# EasyEDA Pro project ProPrj_无线即时通信_2025-03-31.epro, board 生产板
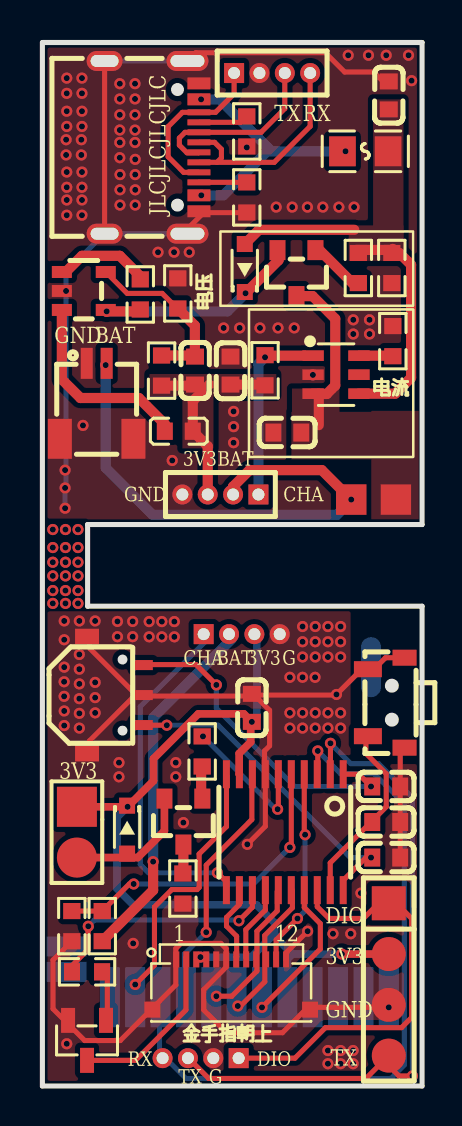
[diagram p8: board, top side]
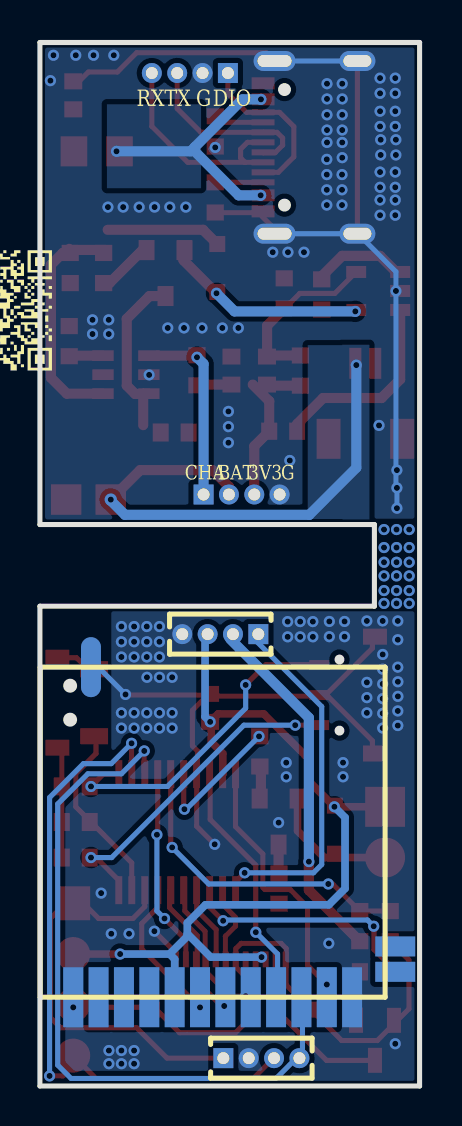
[diagram p9: board, bottom side, seen from below]

Outline 19.02 x 52.2 mm; copper layers: Top Layer, Bottom Layer. Coordinates in mm from the lower left corner of the outline.
Outline path: 0,52.2 0,0 19.02,0 19.02,24 2.26,24 2.26,28.09 19.02,28.09 19.02,52.2 0,52.2
Stack: Top Layer 0.035mm - / Dielectric1 1.51mm FR4 er 4.5 / Bottom Layer 0.035mm -

## Design rules (mm)
template: 自定义配置
spacing copperThickness1oz (default): track to track 0.102, other pairs 0.152 to 0.3
spacing copperThickness2oz: track to track 0.203, other pairs 0.152 to 0.3
track width copperThickness1oz (default): min 0.127, default 0.254, max 2.54
track width copperThickness2oz: min 0.203, default 0.254, max 2.54
differential pair differentialPair (default): width min 0.127, default 0.254, max 2.54; gap min 0.152, default 0.152
via viaSize (default): diameter min 0.5, default 0.61, max 10; hole min 0.3, default 0.305, max 6.3

## Placement (name value [footprint] x y rotation side)
C2  100nF  [C0603]  10.49 18.92 270 top
C10  100nF  [C0603]  17.22 14.98 0 top
C11  100nF  [C0603]  17.22 11.43 0 top
C32  4.7uf  [C0603]  17.35 49.55 270 top
C40  47pF  [C0603]  7.64 35.79 270 top
C41  22uf  [C0603]  9.42 35.79 90 top
C56  100nF  [C0603]  17.22 13.21 0 top
C57  1uf  [C0603]  12.27 32.69 0 top
D6  B5819WS  [SOD-323F_L1.7-W1.3-LS2.5-R-RD-1]  10.13 40.92 90 top
D7  B5819WS  [SOD-323F_L1.7-W1.3-LS2.5-R-RD-1]  4.24 12.82 270 top
FPC1  AFH34-S12FIA-1H  [FPC-SMD_12P-P0.50_THD0509-12CL-GF]  9.46 5.08 0 top
H1  PZ254V-11-02P  [HDR-TH_2P-P2.54-V-M]  1.73 12.7 270 top
H2  PZ254V-11-04P  [HDR-TH_4P-P2.54-V-M]  17.35 5.33 270 top
H3  PZ127V-11-04-0720  [HDR-TH_4P-P1.27-V-M]  7.92 1.39 180 bottom
H4  PZ127V-11-04-0720  [HDR-TH_4P-P1.27-V-M]  9.98 22.6 0 bottom
L15  2.2uH  [L0603]  6.83 32.75 180 top
Q6  AO3401A  [SOT-23_L2.9-W1.3-P0.95-LS2.4-BR]  7.06 13.23 90 top
Q7  AO3401A  [SOT-23_L2.9-W1.3-P0.95-LS2.4-BR]  12.72 40.66 90 top
R4  1MΩ  [R0603]  3 8 270 top
R5  1MΩ  [R0603]  1.47 8 90 top
R45  200k  [R0603]  5.97 35.79 270 top
R46  100k  [R0603]  6.78 39.65 270 top
R47  100kΩ  [R0603]  4.9 39.6 90 top
R58  5.1kΩ  [R0603]  10.24 44.45 270 top
R59  5.1kΩ  [R0603]  10.24 47.75 270 top
R62  2.2k  [R0603]  2.23 5.71 0 top
R63  100kΩ  [R0603]  17.5 40.92 90 top
R64  100kΩ  [R0603]  15.82 40.92 270 top
R65  10k  [R0603]  7.04 9.88 270 top
R66  30k  [R0603]  17.55 37.26 270 top
R67  10k  [R0603]  11.15 35.8 90 top
R68  100欧  [R0603]  8 16.74 270 top
SW3  TS24CA 250gf 013  [SW-SMD_L4.7-W3.5-P3.35-EH]  17.22 19.17 270 top
U1  CH32V003F4P6(TSSOP20)  [OLIMEX_IC-FP:TSSOP20_Pitch-0.65mm_6.6x4.5x1.2mm]  12.14 12.7 180 top
U8  SL0805200  [F0805]  16.17 46.75 0 top
U22  ETA3425S2F  [SOT-23-5_L2.9-W1.6-P0.95-LS2.8-BL]  2.07 39.77 270 top
U23  -  [e5e8]  2.49 19.56 90 top
U24  XL1278-SMT  [SX1278]  10.36 12.7 180 bottom
U25  SS8050  [SOT-23-3_L2.9-W1.3-P1.90-LS2.4-BR]  2.23 2.28 90 top
U29  CS-1254R-02  [CONN-SMD_2P-P1.00_CS-1254R-02]  2.72 34.26 0 top
U30  -  [水银开关]  16.59 29.33 90 top
U35  X1311FV-04-C43D24  [HDR-TH_4P-P1.27-V-F]  11.51 50.67 0 top
U36  X1311FV-04-C43D24  [HDR-TH_4P-P1.27-V-F]  8.91 29.59 180 top
U37  TP4057-42-SOT26-R  [SOT-23-6_L2.9-W1.6-P0.95-LS2.8-BL]  14.71 35.58 270 top
USB2  TYPE-C16PIN  [USB-C-SMD_TYPE-C16PIN]  5.48 46.95 270 top

## Footprints (pads in the part's own frame, mm; a bottom-side part is the same pattern mirrored in y, then rotated)
C0603
  rect 0.8x0.9 smd: 1(-0.7,0) 2(0.7,0)
CONN-SMD_2P-P1.00_CS-1254R-02
  rect 0.6x1.55 smd: 1(-0.5,1.887) 2(0.5,1.887)
  rect 1.2x2 smd: 3(-1.841,-1.887) 4(1.841,-1.887)
e5e8
  rect 0.5x1 smd: 1(-1.5,-2.54) 2(0,-2.54) 3(1.5,-2.54)
  rect 0.8x1.2 smd: 4(-2.921,0.254) 5(2.921,0.254)
F0805
  rect 1.335x1.5 smd: 1(-1.143,0) 2(1.143,0)
FPC-SMD_12P-P0.50_THD0509-12CL-GF
  rect 0.3x0.8 smd: 1(-2.75,1.254) 2(-2.25,1.256) 3(-1.75,1.256) 4(-1.25,1.256) 5(-0.75,1.256) 6(-0.25,1.256) 7(0.25,1.254) 8(0.75,1.256) 9(1.25,1.256) 10(1.75,1.256) 11(2.25,1.256) 12(2.75,1.256)
  rect 0.8x0.8 smd: 13(3.95,-1.256) 14(-3.95,-1.256)
HDR-TH_2P-P2.54-V-M
  rect 2x2 smd: 1(-1.27,0)
  round 2 smd: 2(1.27,0)
HDR-TH_4P-P1.27-V-F
  rect 1x1 hole 0.6: 1(-1.905,0)
  round 1 hole 0.6: 2(-0.635,0) 3(0.635,0) 4(1.905,0)
HDR-TH_4P-P1.27-V-M
  rect 1x1 hole 0.6: 1(-1.905,0)
  round 1 hole 0.6: 2(-0.635,0) 3(0.635,0) 4(1.905,0)
HDR-TH_4P-P2.54-V-M
  rect 1.7x1.7 smd: 1(-3.81,0)
  round 1.7 smd: 2(-1.27,0) 3(1.27,0) 4(3.81,0)
L0603
  rect 0.8x0.864 smd: 1(-0.7,0) 2(0.7,0)
OLIMEX_IC-FP:TSSOP20_Pitch-0.65mm_6.6x4.5x1.2mm
  rect 0.35x1.4 smd: 1(-2.925,-2.9) 2(-2.275,-2.9) 3(-1.625,-2.9) 4(-0.975,-2.9) 5(-0.325,-2.9) 6(0.325,-2.9) 7(0.975,-2.9) 8(1.625,-2.9) 9(2.275,-2.9) 10(2.925,-2.9) 11(2.925,2.9) 12(2.275,2.9) 13(1.625,2.9) 14(0.975,2.9) 15(0.325,2.9) 16(-0.325,2.9) 17(-0.975,2.9) 18(-1.625,2.9) 19(-2.275,2.9) 20(-2.925,2.9)
R0603
  rect 0.806x0.864 smd: 1(-0.753,0) 2(0.753,0)
SOD-323F_L1.7-W1.3-LS2.5-R-RD-1
  rect 0.8x0.8 smd: 1(1.2,0) 2(-1.2,0)
SOT-23-3_L2.9-W1.3-P1.90-LS2.4-BR
  rect 1.25x0.7 smd: 1(1,-0.95) 2(1,0.95) 3(-1,0)
SOT-23-5_L2.9-W1.6-P0.95-LS2.8-BL
  rect 0.6x1 smd: 1(-0.95,-1.1) 2(0,-1.1) 3(0.95,-1.1) 4(0.95,1.1) 5(-0.95,1.1)
SOT-23-6_L2.9-W1.6-P0.95-LS2.8-BL
  rect 0.532x1.072 smd: 1(-0.95,-1.149) 2(0,-1.149) 3(0.95,-1.149) 4(0.95,1.149) 5(0,1.149) 6(-0.95,1.149)
SOT-23_L2.9-W1.3-P0.95-LS2.4-BR
  rect 1x0.8 smd: 1(1.15,-0.95) 2(1.15,0.95) 3(-1.15,0)
SW-SMD_L4.7-W3.5-P3.35-EH
  rect 0.8x1.4 smd: 1(-1.675,-0.917) 2(1.675,-0.917)
  rect 0.8x1.2 smd: 3(-2.25,0.917) 4(2.25,0.917)
SX1278
  rect 1x3 smd: 1(-6.985,-8.255) 2(-5.715,-8.255) 3(-4.445,-8.255) 4(-3.175,-8.255) 5(-1.905,-8.255) 6(-0.635,-8.255) 7(0.635,-8.255) 8(1.905,-8.255) 9(3.175,-8.255) 10(4.445,-8.255) 11(5.715,-8.255) 12(6.985,-8.255)
  rect 2x1 smd: 13(9.144,-6.985) 14(9.144,-5.715)
  oval 1x3 smd: 16(-6.096,8.255)
USB-C-SMD_TYPE-C16PIN
  oval 1x2.1 hole 0.6x1.7: 1(-4.32,1.788) 2(4.32,1.788)
  oval 1x1.8 hole 0.6x1.4: 3(-4.32,-2.362) 4(4.32,-2.362)
  rect 0.6x1.15 smd: A1B12(-3.2,2.362) A4B9(-2.4,2.362) B1A12(3.2,2.362) B4A9(2.4,2.362)
  rect 0.3x1.15 smd: A5(-1.25,2.362) A6(-0.25,2.362) A7(0.25,2.362) A8(-1.75,2.362) B5(1.75,2.362) B6(0.75,2.362) B7(-0.75,2.362) B8(1.25,2.362)
水银开关
  rect 1.524x1.524 smd: 1(0,1.117) 2(0,-1.117)

## Nets
As in the schematic.

Pads without a net: U24 2 3 4 13 14; U37 5

## Via types
v1: diameter 0.559, hole 0.305, Top Layer to Bottom Layer, 196 vias
v2: diameter 0.61, hole 0.305, Top Layer to Bottom Layer, 1 via

## Routing (per net, layer and track width the routed paths; a pad name or vN(x,y) marks a point on that pad's centre or on a via; arc(x,y) is an arc through that point)
3V3: length 55.3
  Top Layer w0.254: FPC1.4 FPC1.3 ; D7.2 4.27,14 v1(4.27,13.97)
  Top Layer w0.381: U1.9 9.85,15.61 9.85,16.63 10.43,17.21 10.43,18.16 ; H2.2 v1(15,6.6) ; H1.1 v1(4.27,13.97) 5.56,15.26 5.56,16.37 7.81,18.62 10.09,18.62 v1(10.49,18.22) 10.43,18.16 ; 10.43,18.16 10.23,18.36
  Top Layer w0.508: R45.2 7.59,35.03 C40.2 ; R67.1 11.11,35.09 C41.1 ; U36.3 8.28,32.01 7.53,32.75 7.53,34.26 8.36,35.09
  Bottom Layer w0.381: 12.52,6.6 12.27,6.35 U24.5 ; 12.52,6.6 v1(15,6.6) ; 12.52,6.6 11.63,7.49 11.63,7.62 ; 11.63,7.62 10.46,6.45 v1(7.92,6.45) ; 11.63,7.62 11.63,8.16 10.72,9.07 4.55,9.07 3.73,9.88 3.73,13.43 v1(4.27,13.97) ; v1(10.49,18.22) 10.74,18.47 10.74,22.46
GND: length 116.4
  Top Layer w0.254: v1(13.28,7.74) 12.21,6.67 12.21,6.46 ; SW3.4 17.92,16.71 C56.2 C11.2 ; U1.7 11.17,12.99 v1(10.26,12.09) ; 2.36,22.48 2.36,21.9 4.68,19.58 2.36,17.27 2.36,16.63 ; R58.2 10.23,43.69 8.08,43.69 7.26,42.87 USB2.2 ; v1(17.35,3.93) 13.29,3.93 12.02,2.66 9.22,2.66 8.08,3.81 8.08,4.82 9.21,5.95 FPC1.6 9.21,6.87 8.94,7.13 6.94,7.13 6.68,6.88 6.68,5.06 3.9,2.27 2.12,2.27 0.53,3.86 0.53,6.3 R5.1 ; C2.1 10.56,19.62 10.62,19.56 ; C2.1 10.55,19.56 10.62,19.56 ; C2.1 10.38,19.5 5.08,19.5 U23.2 ; USB2.3 USB2.4 ; 10.62,19.56 14.7,19.56 v1(14.73,19.59) 15.99,20.85 16.61,20.85 17.19,21.42 SW3.3 ; 10.62,19.56 11.38,18.79 11.38,17.02 11.12,16.76 11.12,15.64 ; 17.19,50.12 16.59,50.72 15.14,50.72 14.17,51.69 7.68,51.69 USB2.1
  Bottom Layer w0.254: v1(14.73,19.59) 16.1,20.95 U24.16 ; 8.03,42.63 3.09,42.63 1.19,40.73 v1(1.19,39.77) 1.19,29.97 v1(1.14,29.92) v1(1.14,28.9) ; 8.03,51.27 3.88,51.27
  vias: v1(0.52,27.84) v1(0.52,26.94) v1(0.52,26.2) v1(0.52,25.52) v1(0.52,24.78) v1(0.52,24.14) v1(1.09,20.22) v1(1.09,19.49) v1(1.19,47.33) v1(1.19,46.57) v1(1.14,30.81) v1(1.16,27.84) v1(1.16,26.94) v1(1.16,26.2) v1(1.16,25.52) v1(1.16,24.78) v1(1.16,24.14) v1(1.09,23.26) v1(1.09,22.32) v1(1.09,20.95) v1(1.09,18.76) v1(1.09,18.03) v1(1.22,50.42) v1(1.22,49.65) v1(1.22,48.76) v1(1.22,48) v1(1.22,45.72) v1(1.22,44.96) v1(1.22,44.32) v1(1.22,43.56) v1(1.22,2.11) v1(1.78,27.84) v1(1.78,26.94) v1(1.78,26.2) v1(1.78,25.52) v1(1.78,24.78) v1(1.78,24.14) v1(1.85,23.26) v1(1.85,21.59) v1(1.85,20.85) v1(1.85,20.11) v1(1.85,19.38) v1(1.85,18.64) v1(1.85,17.9) v1(1.98,50.42) v1(1.98,49.65) v1(1.98,48.76) v1(1.98,48) v1(1.95,47.33) v1(1.95,46.57) v1(1.98,45.72) v1(1.98,44.96) v1(1.98,44.32) v1(1.98,43.56) v1(2.03,33.04) v1(2.64,23.26) v1(2.64,20.19) v1(2.64,19.43) v1(2.64,18.67) v1(3.76,23.24) v1(3.76,22.48) v1(3.88,50.14) v1(3.88,49.37) v1(3.88,48.58) v1(3.88,47.82) v1(3.88,47.2) v1(3.88,46.44) v1(3.89,45.59) v1(3.89,44.83) v1(3.89,44.07) v1(3.84,16.18) v1(3.84,15.47) v1(4.52,23.24) v1(4.52,22.48) v1(4.55,7.13) v1(4.64,50.14) v1(4.64,49.37) v1(4.64,48.58) v1(4.64,47.82) v1(4.64,47.2) v1(4.65,46.35) v1(4.65,45.59) v1(4.65,44.83) v1(4.65,44.07) v1(5.35,23.23) v1(5.35,22.47) v1(5.79,41.71) v1(5.98,23.23) v1(5.98,22.47) v1(6.5,31.29) v1(6.59,41.71) v1(6.61,23.23) v1(6.61,22.47) v1(6.68,16.18) v1(6.68,15.47) v1(7.06,13.18) v1(7.36,41.71) v1(9.08,37.92) v1(9.58,33.74) v1(9.58,32.98) v1(9.58,32.18) v1(9.88,37.92) v1(10.24,46.95) v1(10.9,37.92) v1(11.71,43.96) v1(11.8,37.92) v1(12.39,20.44) v1(12.39,18.67) v1(12.39,17.9) v1(12.51,43.96) v1(12.61,37.92) v1(13.03,22.98) v1(13.03,22.22) v1(13.03,21.46) v1(13.03,20.44) v1(13.03,18.67) v1(13.03,17.9) v1(13.27,43.96) v1(13.55,35.57) v1(13.66,22.98) v1(13.66,22.22) v1(13.66,21.46) v1(13.66,20.44) v1(13.66,18.67) v1(13.66,17.9) v1(14.05,43.96) v1(14.3,22.98) v1(14.3,22.22) v1(14.3,21.46) v1(14.3,18.67) v1(14.3,17.9) v1(14.3,1.78) v1(14.3,1.12) v1(14.55,7.62) v1(14.85,43.96) v1(14.94,22.98) v1(14.94,22.22) v1(14.94,21.46) v1(14.94,18.67) v1(14.94,17.9) v1(14.94,1.78) v1(14.94,1.12) v1(15.32,51.56) v1(15.44,7.62) v1(15.57,38.33) v1(15.57,37.61) v1(15.56,1.78) v1(15.56,1.12) v1(15.61,43.96) v1(15.95,9.65) v1(16.33,51.56) v1(16.38,38.33) v1(16.38,37.61) v1(17.22,51.56) v1(18.34,51.56) v1(18.49,50.29)
VIN: length 17.4
  Top Layer w0.508: 15.62,42.83 10.85,42.83 D6.1 ; 15.74,41.82 17.5,41.82 17.55,41.87 ; R63.2 17.87,41.67 18.47,41.08 18.47,35.43 17.67,34.63 U37.4
VIN1: length 12.7
  Bottom Layer w0.508: 11.26,46.97 8.87,49.35 v1(7.95,49.35) ; 11.26,46.97 11.26,46.75 9.06,44.55 v1(7.96,44.55) ; 11.26,46.97 11.47,46.75 v1(15.18,46.75)
BATTERY: length 15.9
  Top Layer w0.254: v1(12.39,11.94) 12.47,12.01 U1.5 ; v1(4.57,10.11) 4.35,10.11 R4.1 R5.2
  Bottom Layer w0.254: v1(12.39,11.94) 10.57,10.11 v1(4.57,10.11)
BVIN: length 43.8
  Top Layer w0.508: R4.2 5.55,9.79 v1(5.55,11.22) ; U36.2 9.55,29.99 10.37,30.81 14,30.81 v2(15.47,29.33)
  Bottom Layer w0.508: v1(5.55,11.22) 5.55,18.42 9.47,22.35 ; v1(3.17,36.06) 3.17,30.93 5.52,28.57 14.76,28.57 15.47,29.28 v2(15.47,29.33)
BVIN+: length 8.7
  Top Layer w0.508: 17.57,29.33 U30.2 ; U37.3 13.83,34.63 13.84,34.62 ; 13.84,34.62 14.25,34.62 14.67,35.04 14.67,38.38 13.53,39.51 Q7.3 ; 13.84,34.62 13.84,33.06
CHARGE: length 26.7
  Top Layer w0.254: U1.11 9.22,10.21 v1(8.76,10.67)
  Top Layer w0.508: R67.2 11.17,36.53 13.15,36.53
  Bottom Layer w0.254: 8.2,22.28 4.9,18.98 4.9,11.08 5.31,10.67 v1(8.76,10.67)
  Bottom Layer w0.508: v1(11.15,36.45) 10.82,36.12 U36.1
D+: length 46.4
  Top Layer w0.254: 8.74,46.2 11.61,46.2 13.41,48 U35.4 ; 8.74,46.2 8.97,46.43 8.97,46.86 8.62,47.2 USB2.A6 ; 8.74,46.2 USB2.B6 ; v1(13.79,16.76) 13.79,15.7
  Bottom Layer w0.254: v1(13.79,16.76) 14.94,15.62 16.61,15.62 18.13,14.11 18.13,1.05 17.46,0.38 7.19,0.38 5.87,1.7 5.87,4.39 U24.10
D-: length 42.9
  Top Layer w0.254: U1.2 14.43,15.61 v1(14.43,17.14) ; v1(18.53,0.5) 17.86,0.5 17.35,1.01 H2.4 16.2,0.38 8.33,0.38 7.19,1.52 ; U35.3 12.14,48.89 10.95,47.7 USB2.B7 7.14,47.7 6.86,47.42 6.86,47.06 7.24,46.68 7.82,46.68 USB2.A7
  Bottom Layer w0.254: v1(14.43,17.14) 15.44,16.13 16.84,16.13 18.53,14.43 v1(18.53,0.5)
EN_MOTOR: length 7.1
  Top Layer w0.254: v1(11.78,13.85) 11.82,13.85 U1.6
  Bottom Layer w0.254: v1(8.04,17.49) 11.74,13.8 11.84,13.8
FBK: length 8.8
  Top Layer w0.254: U22.5 4.25,39.65 6,39.65 6.75,38.89 R46.2
  Top Layer w0.508: 7.64,36.49 7.64,36.47 ; 7.64,36.49 C40.1 ; 7.64,36.49 7.64,38.04 R46.2 ; 7.64,36.49 7.59,36.54 R45.1
LEDK: length 8.7
  Top Layer w0.254: 7.21,6.46 7.19,6.44 7.19,3.81 4.66,1.28 U25.3
LORA_CS: length 12.6
  Top Layer w0.254: v1(8.2,7.69) 8.21,7.7 8.21,11.05 10.49,13.33 10.49,15.57 U1.8
  Bottom Layer w0.254: U24.9 7.11,4.52 7.11,6.6 v1(8.2,7.69)
LORA_RST: length 13.2
  Top Layer w0.254: U1.10 9.22,15.59 9.22,12.98 7.85,11.61 7.85,9.93 7.75,9.83 6.48,9.83 5.61,8.96 5.61,6.04 v1(4.65,5.08)
MISO: length 7.4
  Top Layer w0.254: v1(11,3.93) 13.92,6.86 13.92,8.12 13.12,8.93 U1.17
MOSI: length 7
  Top Layer w0.254: 12.52,9.8 12.52,8.92 11.14,7.53 11.14,5.22 9.92,4 v1(9.79,4)
POWER: length 12.1
  Top Layer w0.508: v1(3.22,38.75) 4.81,38.75 R47.1 ; 11.83,41.97 11.83,41.31 v1(10.17,39.65)
  Bottom Layer w0.508: v1(3.22,38.75) 9.27,38.75 v1(10.17,39.65)
SCL: length 6.9
  Top Layer w0.254: v1(8.71,4.49) 9.49,4.49 10.74,5.75 10.74,7.74 11.76,8.76 11.76,9.73
SCREEN_BL: length 12.1
  Top Layer w0.254: R62.1 1.48,6.02 2.29,6.83 2.29,7.76 2.3,7.78 v1(2.3,7.99) ; U1.13 10.52,8.94 v1(9.84,8.27)
  Bottom Layer w0.254: 9.84,8.26 9.8,8.3 2.61,8.3 v1(2.3,7.99)
SCREEN_CS: length 3.7
  Top Layer w0.254: 10.21,6.46 10.19,6.48 10.19,7.82 11.17,8.8 U1.14
SCREEN_DC: length 3.8
  Top Layer w0.254: 9.71,6.46 9.73,6.48 9.73,7.49 9.22,8 9.22,8.43 9.87,9.08 U1.12
SCREEN_RST: length 9.9
  Top Layer w0.254: v1(13.16,12.57) 13.12,12.61 U1.4 ; v1(12.78,8.38) 11.71,7.31 FPC1.11
  Bottom Layer w0.254: v1(12.78,8.38) 13.16,8.76 v1(13.16,12.57)
SW: length 9.1
  Top Layer w0.254: U1.19 14.42,11.16 17.22,13.97 17.22,15.62 16.2,16.63 16.2,17.25 16.3,17.25
SWA: length 16.6
  Top Layer w0.254: U1.1 15.84,15.6 v1(16.46,14.98) ; v1(8.71,20.06) 7.7,21.08 4.72,21.08
  Bottom Layer w0.254: v1(16.46,14.98) 12.63,14.98 8.71,18.9 v1(8.71,20.06)
SWB: length 16.5
  Top Layer w0.254: U23.1 5.04,18.05 v1(6.23,18.05) ; v1(16.46,11.43) 16.2,11.43 15.06,10.28 15.06,9.8 U1.20
  Bottom Layer w0.254: v1(6.23,18.05) 8.8,18.05 15.42,11.43 v1(16.46,11.43)
SWIO: length 29.4
  Top Layer w0.254: H3.1 12.65,1.39 14.17,2.92 17.98,2.92 18.49,3.43 18.49,8.38 17.73,9.14 H2.1 16.84,9.14 16.08,8.38 14.36,8.38 13.77,8.97 U1.18 ; USB2.B8 7.07,45.7 6.3,46.48 6.3,47.99 7.01,48.7 USB2.A8 8.67,48.7 9.6,49.64 9.6,50.8
$1N1346: length 6.3
  Top Layer w0.381: 6.11,14.38 6.11,12.76 4.78,11.43 1.98,11.43
$1N2494: length 4.6
  Top Layer w0.508: R47.2 4.9,40.5 3.88,41.53 1.98,41.53 1.17,40.72
$1N2496: length 9.9
  Top Layer w0.508: L15.2 6.13,33.11 4.83,34.41 1.91,34.41 0.97,35.34 U22.3
$1N3170: length 2.5
  Top Layer w0.254: 10.21,48.49 9.93,48.2 USB2.A5
$1N3180: length 2.6
  Top Layer w0.254: USB2.B5 10.47,45.2
$1N4201: length 2.6
  Top Layer w0.254: 3.19,3.28 3.25,3.35 3.25,5.45 R62.2
$1N45129: length 2.8
  Top Layer w0.508: 13.73,41.97 15.53,40.16 15.82,40.16
$1N45683: length 1.7
  Top Layer w0.508: R66.2 17.52,36.53 U37.6
$1N45972: length 1.5
  Top Layer w0.508: Q6.3 7.06,10.66 R65.1
$1N46012: length 1.7
  Top Layer w0.508: 7.95,16.08 7.95,14.44 Q6.1

## Copper pours and planes (outline as drawn; the poured copper is in the pictures)
3V3 on Top Layer: 7.01,35.5 8.57,35.5 8.57,31.89 7.01,31.89
3V3 on Top Layer: 5.36,35.62 11.71,35.62 11.71,34.52 5.36,34.52
GND on Top Layer: -2.49,55.14 20.88,55.14 20.88,-3.15 -2.49,-3.15
GND on Bottom Layer: -4.24,53.84 20.14,53.84 20.14,-4.19 -4.24,-4.19
VIN on Top Layer: 15.34,43.05 18.08,43.05 18.08,41.27 15.34,41.27
VIN on Top Layer: 16.56,49.35 18.08,49.35 18.08,41.42 16.56,41.42
VIN1 on Bottom Layer: 10.94,49.11 15.66,49.11 15.66,44.91 10.94,44.91
BVIN on Bottom Layer: 2.51,37.08 3.87,37.08 3.87,28.34 2.51,28.34
BVIN on Bottom Layer: 3.67,37.06 5.6,37.06 5.6,28.36 3.67,28.36
BVIN+ on Top Layer: 16.47,33.77 18.85,33.77 18.85,28.35 16.47,28.35
BVIN+ on Top Layer: 12.5,34.89 14.88,34.89 14.88,31.45 12.5,31.45
BVIN+ on Top Layer: 12.47,33.72 17.89,33.72 17.89,31.35 12.47,31.35

## Text on the board
Bottom Silkscreen Layer: 3V3 | BAT | CHA | G | TX | RX | DIO
Top Layer: 1mm板厚
Top Silkscreen Layer: 有32个报错正常 | JLCJLCJLCJLC | GND | RX | TX | 3V3 | CHA | G | BAT | DIO | 金手指朝上 | 电流 | 电压 | 1 | 12
